# EAGLE design power (EAGLE 8.0.2)
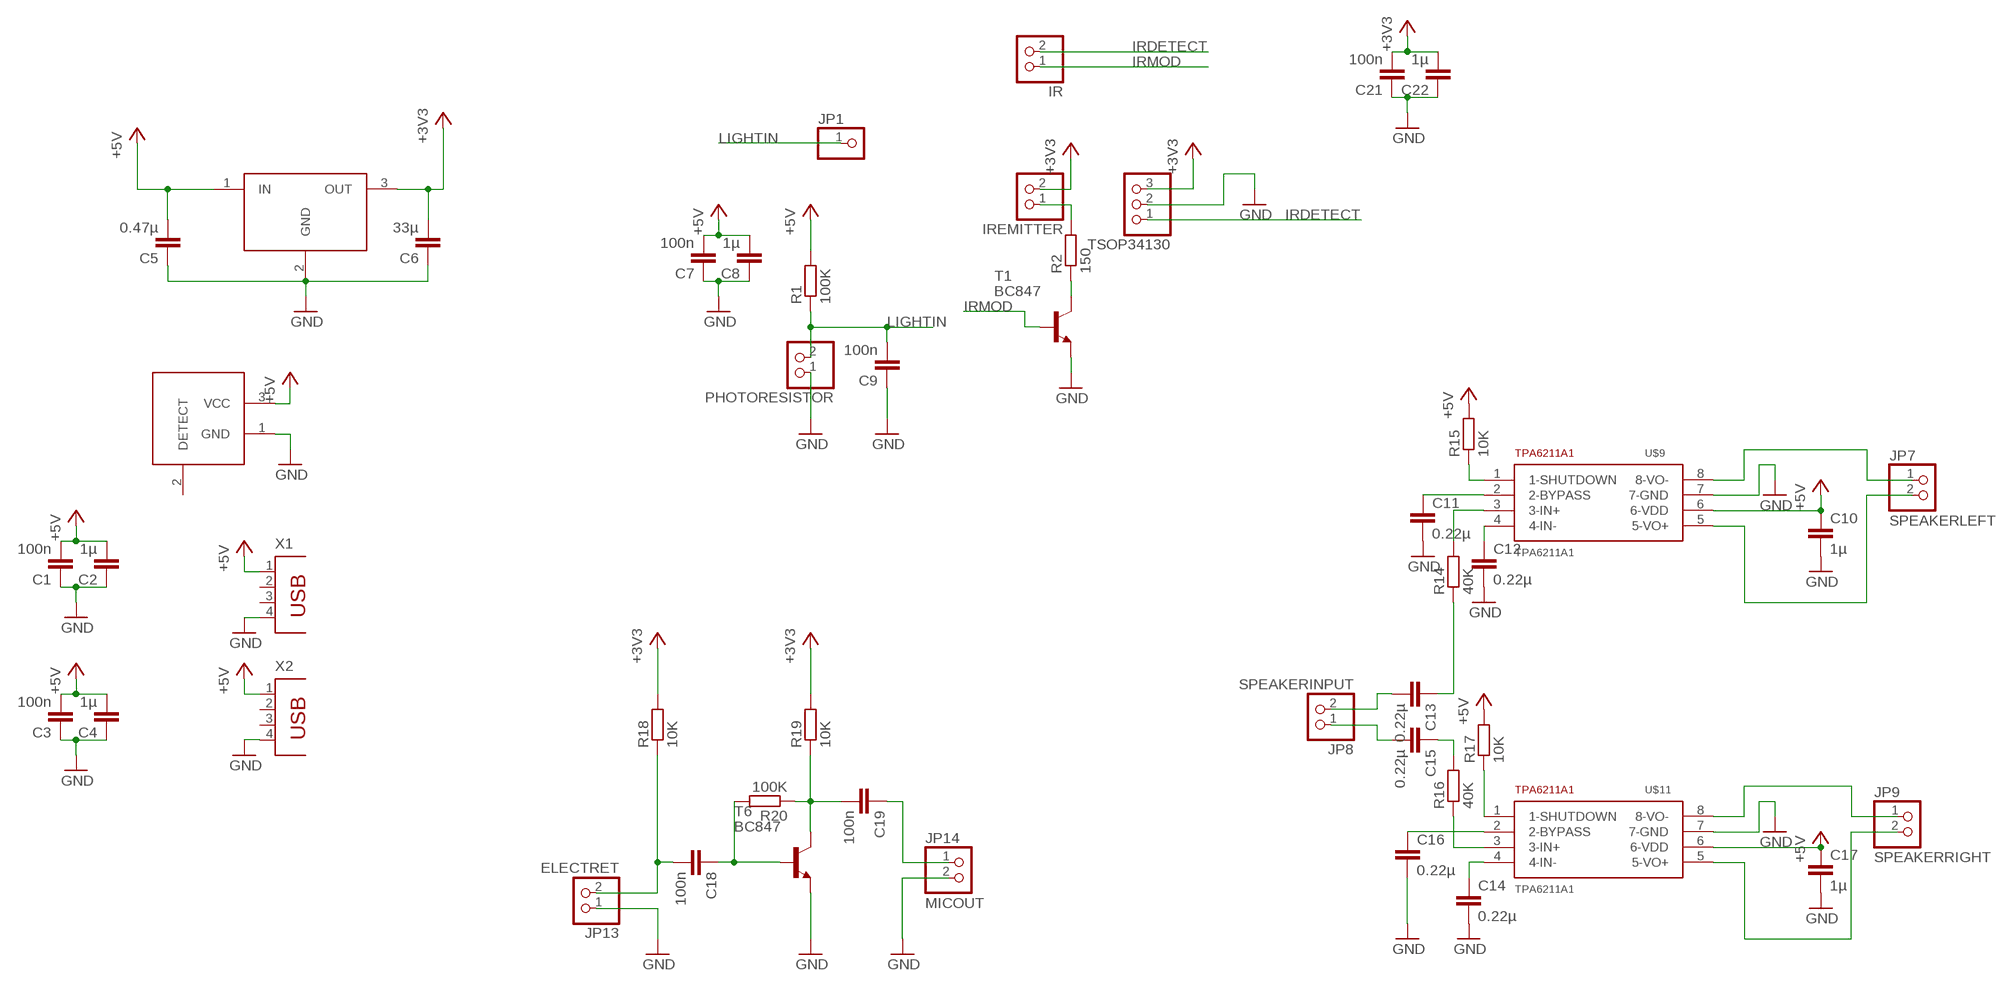
[diagram p0: schematic, sheet 1]

## Parts
C1  100n  C-EUC0805  [C0805]
C2  1µ  C-EUC0805  [C0805]
C3  100n  C-EUC0805  [C0805]
C4  1µ  C-EUC0805  [C0805]
C5  0.47µ  C-EUC0805  [C0805]
C6  33µ  C-EUC0805  [C0805]
C7  100n  C-EUC0805  [C0805]
C8  1µ  C-EUC0805  [C0805]
C9  100n  C-EUC0805  [C0805]
C10  1µ  C-EUC0805  [C0805]
C11  0.22µ  C-EUC0805  [C0805]
C12  0.22µ  C-EUC0805  [C0805]
C13  0.22µ  C-EUC0805  [C0805]
C14  0.22µ  C-EUC0805  [C0805]
C15  0.22µ  C-EUC0805  [C0805]
C16  0.22µ  C-EUC0805  [C0805]
C17  1µ  C-EUC0805  [C0805]
C18  100n  C-EUC0805  [C0805]
C19  100n  C-EUC0805  [C0805]
C21  100n  C-EUC0805  [C0805]
C22  1µ  C-EUC0805  [C0805]
IR  PINHD-1X2  [1X02]
IREMITTER  PINHD-1X2  [1X02]
JP1  PINHD-1X1  [1X01]
JP7  SPEAKERLEFT  PINHD-1X2  [1X02]
JP8  SPEAKERINPUT  PINHD-1X2  [1X02]
JP9  SPEAKERRIGHT  PINHD-1X2  [1X02]
JP13  ELECTRET  PINHD-1X2  [1X02]
JP14  MICOUT  PINHD-1X2  [1X02]
PHOTORESISTOR  PINHD-1X2  [1X02]
R1  100K  R-EU_R0805  [R0805]
R2  150  R-EU_R0805  [R0805]
R14  40K  R-EU_R0805  [R0805]
R15  10K  R-EU_R0805  [R0805]
R16  40K  R-EU_R0805  [R0805]
R17  10K  R-EU_R0805  [R0805]
R18  10K  R-EU_R0805  [R0805]
R19  10K  R-EU_R0805  [R0805]
R20  100K  R-EU_R0805  [R0805]
T1  BC847  [SOT23]
T6  BC847  [SOT23]
TSOP34130  PINHD-1X3  [1X03]
U$1  LM3940IMP-3.3  [SOT223]
U$2  POWERPLUG  [DC10LPSOCKET]
U$9  TPA6211A1  [MSOP8]
U$11  TPA6211A1  [MSOP8]
X1  PN87520  [PN87520]
X2  PN87520  [PN87520]

## Nets
+3V3: C6.2 C21.2 C22.2 IREMITTER.2 R18.2 R19.2 TSOP34130.3 U$1.3(OUT)
+5V: C1.2 C2.2 C3.2 C4.2 C5.2 C7.2 C8.2 C10.1 C17.1 R1.2 R15.2 R17.2 U$1.1(IN) U$2.3(VCC) U$9.6(6-VDD) U$11.6(6-VDD) X1.1 X2.1
GND: C1.1 C2.1 C3.1 C4.1 C5.1 C6.1 C7.1 C8.1 C9.1 C10.2 C11.2 C12.2 C14.2 C16.2 C17.2 C21.1 C22.1 JP13.1 JP14.2 PHOTORESISTOR.1 T1.2(E) T6.2(E) TSOP34130.2 U$1.2(GND) U$2.1(GND) U$9.7(7-GND) U$11.7(7-GND) X1.4 X2.4
IRDETECT: IR.2 TSOP34130.1
IRMOD: IR.1 T1.1(B)
LIGHTIN: C9.2 JP1.1 PHOTORESISTOR.2 R1.1
N$1: IREMITTER.1 R2.2
N$3: R2.1 T1.3(C)
N$42: C13.1 R14.1
N$43: C13.2 JP8.2
N$46: JP7.1 U$9.8(8-VO-)
N$47: JP7.2 U$9.5(5-VO+)
N$48: C11.1 U$9.2(2-BYPASS)
N$49: C12.1 U$9.4(4-IN-)
N$50: R14.2 U$9.3(3-IN+)
N$51: C15.2 JP8.1
N$52: C15.1 R16.2
N$53: R15.1 U$9.1(1-SHUTDOWN)
N$54: R16.1 U$11.3(3-IN+)
N$55: C14.1 U$11.4(4-IN-)
N$56: C16.1 U$11.2(2-BYPASS)
N$57: R17.1 U$11.1(1-SHUTDOWN)
N$58: JP9.1 U$11.8(8-VO-)
N$59: JP9.2 U$11.5(5-VO+)
N$60: C19.2 R19.1 R20.1 T6.3(C)
N$65: C18.1 R20.2 T6.1(B)
N$66: C18.2 JP13.2 R18.1
N$67: C19.1 JP14.1
Unconnected: U$2.2(DETECT) X1.2 X1.3 X2.2 X2.3

## Library data of the parts
C1-C19 C21 C22 = resistor:C-EU: CAPACITOR, European symbol
IR IREMITTER JP7-JP9 JP13 JP14 PHOTORESISTOR = pinhead:PINHD-1X2: PIN HEADER
JP1 = pinhead:PINHD-1X1: PIN HEADER
R1 R2 R14-R20 = resistor:R-EU_: RESISTOR, European symbol
T1 T6 = transistor:BC847: NPN TRANSISTOR
TSOP34130 = pinhead:PINHD-1X3: PIN HEADER
U$1 = LM3940:LM3940IMP-3.3: 1A Low Dropout Regulator for 5V to 3.3V Conversion
U$2 = alarm:POWERPLUG
U$9 U$11 = alarm:TPA6211A1
X1 X2 = con-berg:PN87520: BERG USB connector; OC_FARNELL: unknown; OC_NEWARK: unknown

## Board
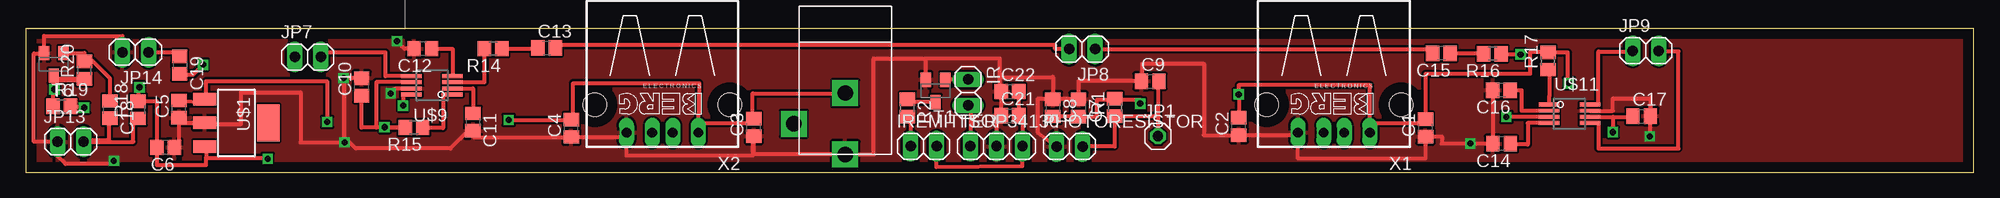
[diagram p1: board, top side]
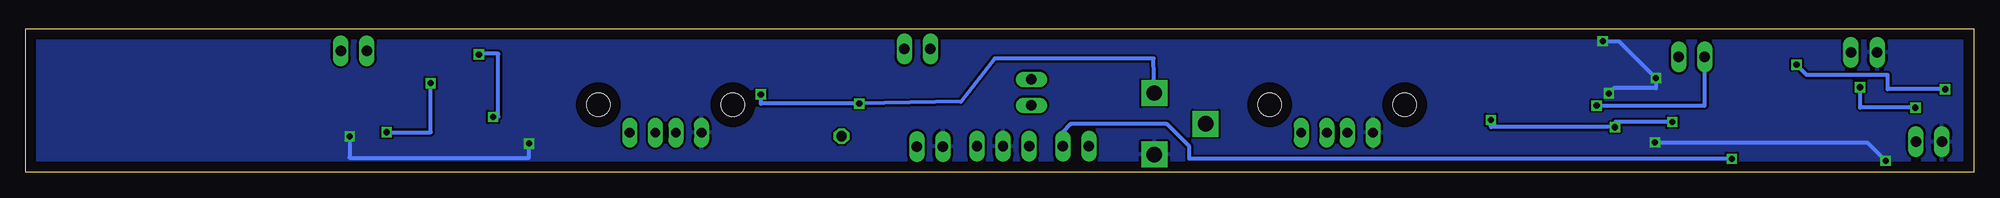
[diagram p2: board, bottom side, seen from below]

Size 190 x 14 mm. Coordinates in mm from the lower left corner, seen from the top.
Outline: 0,0 190,0 190,14 0,14 0,0
Copper layers (1*16): Top 0.035mm / dielectric 1.5mm / Bottom 0.035mm
Design rules "default": minimum track width 10mil, minimum drill 24mil, track to track 8mil, track to pad 8mil, pad to pad 8mil, via to via 8mil, smd to smd 8mil, copper to edge 40mil, drill to drill 8mil, minimum pad ring 10mil, minimum via ring 8mil, stop-mask expansion 4mil, vias tented up to drill 0mil, thermal gap 10mil

### Footprints (pad centres in the part's own frame; a part is rotated, then mirrored left to right if it is on the bottom)
C0805 = smd 1.3 x 1.5: 1 -0.85,0; 2 0.85,0
1X02 = drill 1.016 long: 1 -1.27,0; 2 1.27,0
1X01 = drill 1.016 octagon: 1 0,0
R0805 = smd 1.3 x 1.5: 1 -0.85,0; 2 0.85,0
SOT23 = smd 1 x 1.4: 1 -0.95,-1.1; 2 0.95,-1.1; 3 0,1.1
1X03 = drill 1.016 long: 1 -2.54,0; 2 0,0; 3 2.54,0
SOT223 = smd 1.219 x 2.235: 1 -2.311,-3.099; 2 0,-3.099; 3 2.311,-3.099 | smd 3.6 x 2.2: 4 0,3.099
DC10LPSOCKET = drill 1.5 pad 2.54 square: 1 14.5,-4.5; 2 11.5,-9.5; 3 8.5,-4.5
MSOP8 = smd 0.38 x 2: 1 -1.8,-2.4; 2 -1.2,-2.4; 3 -0.6,-2.4; 4 0,-2.4; 5 0,1.6; 6 -0.6,1.6; 7 -1.2,1.6; 8 -1.8,1.6
PN87520 = drill 0.95 long: 1 -3.5,2.71; 2 -1,2.71; 3 1,2.71; 4 3.5,2.71 | hole 2.3: -6.57,0; 6.57,0

### Placement (x,y rotation side)
C1  136.52,4.32 90 top
C2  118.32,4.47 90 top
C3  71.02,4.37 90 top
C4  53.22,4.29 90 top
C5  14.97,6.16 90 top
C6  13.65,2.42 180 top
C7  102.68,6.28 270 top
C8  100.18,6.29 270 top
C9  109.67,8.88 0 top
C10  32.77,8.33 90 top
C11  43.63,4.89 270 top
C12  38.74,12.07 180 top
C13  50.81,12.13 0 top
C14  143.94,2.77 180 top
C15  138.08,11.62 180 top
C16  143.93,8.02 180 top
C17  157.59,5.48 0 top
C18  8.23,6.11 270 top
C19  15.03,10.46 270 top
C21  95.99,5.53 0 top
C22  96.01,7.88 0 top
IR  91.91,7.79 270 top
IREMITTER  87.58,2.53 0 top
JP1  110.43,3.51 0 top
JP7  27.52,11.26 0 top
JP8  103.04,12.04 180 top
JP9  158,11.86 0 top
JP13  4.38,2.98 0 top
JP14  10.71,11.72 180 top
PHOTORESISTOR  101.81,2.51 0 top
R1  106.22,6.32 90 top
R2  85.98,6.27 270 top
R14  45.59,12.07 180 top
R15  37.87,4.37 180 top
R16  143.05,11.57 180 top
R17  148.47,10.87 90 top
R18  10.97,6.09 90 top
R19  3.51,6.43 0 top
R20  5.72,9.97 90 top
T1  88.73,7.94 180 top
T6  2.75,10.54 180 top
TSOP34130  94.68,2.53 0 top
U$1  20.56,4.81 270 top
U$2  84.43,16.23 270 top
U$9  39.24,9.39 90 top
U$11  150.96,4.8 270 top
X1  127.59,6.57 180 top
X2  62.1,6.57 180 top

### Tracks (layer width: path | path; a pad name or v marks a point on that pad's centre or on a via)
+3V3  (via drill 0.6)
  Top 0.406: C22.2 96.84,7.88 C21.2 97.22,5.53 TSOP34130.3 97.2,0.6 88.8,0.5 IREMITTER.2 | U$1.3 17.6,2.5 17.6,1.4 | 17.6,1.4 23.6,1.4 v23.6,1.3 | R19.2 5.7,6.43 v5.7,6.3 | v11.1,8.3 10.97,8.3 R18.2 12.8,6.94 C6.2 12.8,0.7 17.6,0.7 17.6,1.4
  Bottom 0.406: v23.6,1.3 76.5,1.3 76.5,2.5 78.7,4.7 88.1,4.7 88.9,3.9 88.9,2.58 IREMITTER.2 | v5.7,6.3 11.1,6.3 v11.1,8.3
+5V  (via drill 0.6)
  Top 0.406: X2.1 65.7,3.86 65.6,4.8 | 65.6,4.8 70.92,4.8 C3.2 70.9,5.22 70.9,7.7 v79.93,7.7 U$2.3 | C8.2 C7.2 104.5,5.43 104.5,7.1 106.22,7.1 | 106.22,7.1 R1.2 | C17.1 156.74,5.4 U$11.6 154.8,5.4 v154.8,3.9 | v150.5,8.7 150.4,8.7 150.4,11.7 148.47,11.7 R17.2 146.7,11.72 146.7,9.6 136.52,9.6 C1.2 136.52,4.8 131.1,4.8 | 131.1,4.8 X1.1 | 131.1,4.8 131.1,8.5 118.32,8.5 118.32,7.6 | 118.32,7.6 C2.2 | 106.22,7.1 108.7,7.1 v108.7,6.7 | v118.3,7.6 118.32,7.6 | 34.2,4.37 R15.2 37.1,4.37 37.1,4.3 35,4.3 v35,4.4 | 34.2,4.37 32.77,4.37 C10.1 | U$9.6 34.2,8.79 34.2,4.37 | v47.1,5.1 53.22,5.1 C4.2 53.4,5.14 53.4,8.7 65.7,8.7 65.6,4.8 | C5.2 17.46,6.81 U$1.1 17.6,7.12 17.6,8.9 29.4,8.9 v29.4,4.9
  Bottom 0.406: v154.8,3.9 150.5,3.9 v150.5,8.7 | v118.3,7.6 118.3,6.7 v108.7,6.7 98.8,6.9 95.5,11.1 80,11.1 v79.93,7.7 | v47.1,5.1 47.1,4.4 v35,4.4 35,4.9 v29.4,4.9
GND  (via drill 0.6)
  Top 0.406: 95.14,7.88 C21.1 94.68,5.53 TSOP34130.2 | 87.78,11.1 82.7,11.1 82.7,1.73 U$2.1 71.02,1.73 C3.1 70.9,3.52 70.9,1.6 58.6,1.6 X2.4 58.6,3.44 C4.1 53.22,3.4 43.7,3.4 43.7,4.04 C11.2 43.14,4.04 41.4,2.3 32.2,2.3 31.1,3.4 31.1,8.6 31,8.7 31,3 v31.1,2.9 26.8,2.9 26.8,7.8 21,7.8 21,4.7 17.7,4.7 17.7,4.8 15,4.8 15,2.42 C6.1 14.97,2.42 C5.1 14.97,4.81 U$1.2 15.71,4.81 15.7,4.8 | 87.78,11.1 T1.2 | C22.1 95.14,7.88 | 95,9.3 95,11.1 87.78,11.1 | C8.1 C7.1 102.68,8.88 C9.1 108.9,8.88 108.9,10.6 114.9,10.6 114.9,3.6 118.32,3.6 C2.1 124.09,3.62 X1.4 124.09,1.3 136.5,1.3 136.5,3.47 C1.1 138.1,3.47 138.1,2.8 v140.9,2.8 143.09,2.8 C14.2 C16.2 | C8.1 100.18,9.3 95,9.3 | v158.4,3.5 158.4,5.48 C17.2 158.44,7.2 154.8,7.2 154.8,6 U$11.7 | 95.14,7.88 95,7.88 95,9.3 | C8.1 98.7,7.13 98.7,3.9 PHOTORESISTOR.1 | JP14.2 9.44,13.3 1.8,13.3 T6.2 1.8,11.6 0.8,11.6 0.8,2.98 JP13.1 3.1,1.6 3.9,0.8 8.4,0.8 8.6,1 v8.6,1.1 | C10.2 31.02,9.18 v31,9.2 | v35.6,7.7 35.6,7.8 35.9,8.1 36,8.1 36.1,8.2 U$9.7 | C12.2 36.93,12.07 v36.2,12.8
  Bottom 0.406: v158.4,3.5 158.4,1.4 140.9,1.4 v140.9,2.8 | v35.6,7.7 35.1,8.2 31,8.2 v31,9.2 34.6,12.8 v36.2,12.8 | v31.1,2.9 10.4,2.9 v8.6,1.1
  pour Top: -0.1,14.1 -0.1,-0.2 190.1,-0.2 190.1,14.1
  pour Bottom: -0.1,14 -0.1,-0.2 190.1,-0.2 190.1,-0.1 190.1,14.1 -0.1,14.1
IRDETECT
  Top 0.406: IR.2 92.14,6.52 TSOP34130.1
IRMOD
  Top 0.406: IR.1 89.68,9.06 T1.1
LIGHTIN
  Top 0.406: C9.2 110.43,8.88 JP1.1 110.43,5.47 R1.1 106.2,5.47 106.2,2.5 PHOTORESISTOR.2
N$1
  Top 0.406: R2.2 86.31,5.42 IREMITTER.1
N$3
  Top 0.406: T1.3 85.98,6.84 R2.1
N$42
  Top 0.406: R14.1 49.96,12.07 C13.1
N$43
  Top 0.406: JP8.2 100.4,12.04 100.4,12.4 51.66,12.4 C13.2
N$46  (via drill 0.6)
  Top 0.406: U$9.8 36.8,7.59 v36.8,6.5
  Bottom 0.406: v36.8,6.5 26.25,6.5 JP7.1
N$47
  Top 0.406: U$9.5 35.1,9.39 35.1,11.7 28.79,11.7 JP7.2
N$48
  Top 0.406: U$9.2 43.63,8.19 C11.1
N$49
  Top 0.406: C12.1 41.64,12.07 U$9.4
N$50
  Top 0.406: U$9.3 44.74,8.79 R14.2
N$51
  Top 0.406: JP8.1 137.23,12.04 C15.2
N$52
  Top 0.406: C15.1 142.2,11.62 R16.2
N$53
  Top 0.406: U$9.1 40.7,7.59 40.7,4.3 38.72,4.3 R15.1
N$54  (via drill 0.6)
  Top 0.406: U$11.3 v144.4,5.4 | v145.8,11.5 143.9,11.5 R16.1
  Bottom 0.406: v144.4,5.4 143.9,5.4 R16.1 145.8,11.57 v145.8,11.5
N$55
  Top 0.406: U$11.4 146.5,4.8 146.5,2.7 144.79,2.7 C14.1
N$56
  Top 0.406: U$11.2 145.9,6 145.9,8 144.78,8 C16.1
N$57
  Top 0.406: R17.1 148.6,10.02 148.6,7.4 148.56,7.4 U$11.1
N$58
  Top 0.406: U$11.8 153.4,6.6 153.4,11.8 156.73,11.8 JP9.1
N$59
  Top 0.406: U$11.5 153.4,4.8 153.4,2.3 161.2,2.3 161.2,11.8 159.27,11.8 JP9.2
N$60  (via drill 0.6)
  Top 0.406: R19.1 2.66,9.44 T6.3 2.8,9.44 2.8,9 5.72,9 R20.1 2.8,9.12 v2.8,8.1 | v17.3,10.5 16.3,9.5 15.14,9.5 C19.2
  Bottom 0.406: v2.8,8.1 8.4,8.1 8.4,9.5 16.3,9.5 v17.3,10.5
N$65
  Top 0.406: T6.1 5.72,11.64 R20.2 6,10.82 6,10.9 6.5,10.9 8.2,9.2 8.2,6.99 C18.1
N$66
  Top 0.406: C18.2 8.1,5.26 8.1,3.1 5.65,3.1 JP13.2 10.5,2.98 10.5,5.2 10.97,5.2 R18.1
N$67
  Top 0.406: JP14.1 15.43,11.72 C19.1